# Altium schematic sheet MCU.SchDoc
size 228 x 127 mm; SheetNumber: 3; SheetTotal: 5
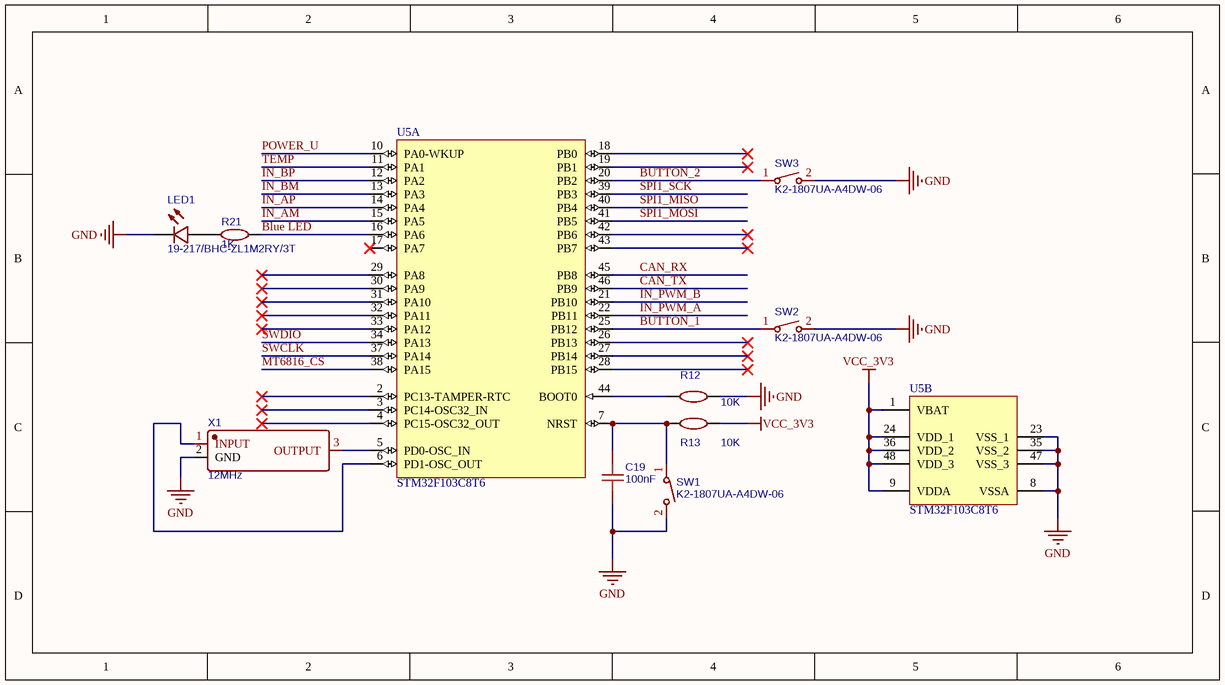
[diagram p0: MCU.SchDoc]

## Parts
C19  100nF  [C0603]
LED1  19-217/BHC-ZL1M2RY/3T  [LED0603-R-RD_BLUE]
R12  10K  [R0603]
R13  10K  [R0603]
R21  1K  [R0603]
SW1  K2-1807UA-A4DW-06  [KEY-SMD_L4.0-W2.9-L]
SW2  K2-1807UA-A4DW-06  [KEY-SMD_L4.0-W2.9-L]
SW3  K2-1807UA-A4DW-06  [KEY-SMD_L4.0-W2.9-L]
U5  STM32F103C8T6  [STM-LQFP48_L]  (parts A,B of 2)
X1  12MHz  [CRYSTAL-SMD_3P-L3.2-W1.3-P1.2-BL]

## Nets
GND: C19.1 LED1.2(C) R12.2 SW1.2 SW2.2 SW3.2 U5.8(VSSA) U5.23(VSS_1) U5.35(VSS_2) U5.47(VSS_3) X1.2(GND)
VCC_3V3: R13.2 U5.1(VBAT) U5.9(VDDA) U5.24(VDD_1) U5.36(VDD_2) U5.48(VDD_3)
Blue LED: R21.2 U5.16(PA6)
BUTTON_1: SW2.1 U5.25(PB12)
BUTTON_2: SW3.1 U5.20(PB2)
CAN_RX: U5.45(PB8)
CAN_TX: U5.46(PB9)
IN_AM: U5.15(PA5)
IN_AP: U5.14(PA4)
IN_BM: U5.13(PA3)
IN_BP: U5.12(PA2)
IN_PWM_A: U5.22(PB11)
IN_PWM_B: U5.21(PB10)
MT6816_CS: U5.38(PA15)
POWER_U: U5.10(PA0-WKUP)
SPI1_MISO: U5.40(PB4)
SPI1_MOSI: U5.41(PB5)
SPI1_SCK: U5.39(PB3)
SWCLK: U5.37(PA14)
SWDIO: U5.34(PA13)
TEMP: U5.11(PA1)
NetC19_2: C19.2 R13.1 SW1.1 U5.7(NRST)
NetLED1_1: LED1.1(A) R21.1
NetR12_1: R12.1 U5.44(BOOT0)
NetU5_5: U5.5(PD0-OSC_IN) X1.3(OUTPUT)
NetU5_6: U5.6(PD1-OSC_OUT) X1.1(INPUT)

Not connected (* = marked no-connect by the designer): U5 2(PC13-TAMPER-RTC)* 3(PC14-OSC32_IN)* 4(PC15-OSC32_OUT)* 17(PA7)* 18(PB0)* 19(PB1)* 26(PB13)* 27(PB14)* 28(PB15)* 29(PA8)* 30(PA9)* 31(PA10)* 32(PA11)* 33(PA12)* 42(PB6)* 43(PB7)*

## Library data of the parts
C19 = 100nF: BOM_Manufacturer: SAMSUNG; BOM_Manufacturer Part: CL10B104KB8NNNC; nameAlias: Capacitance; BOM_Supplier: LCSC; BOM_Supplier Part: C1591; BOM_JLCPCB Part Class: Extended Part; spicePre: C; spiceSymbolName: CL10B104KB8NNNC
LED1 = 19-217/BHC-ZL1M2RY/3T: BOM_Manufacturer: EVERLIGHT; BOM_Supplier: LCSC; BOM_Manufacturer Part: 19-217/BHC-ZL1M2RY/3T; BOM_Supplier Part: C72041; BOM_JLCPCB Part Class: Basic Part; spicePre: L; spiceSymbolName: 19-217/BHC-ZL1M2RY/3T
R12 R13 = 10K: BOM_Manufacturer: UniOhm; BOM_Manufacturer Part: 0603WAF1002T5E; nameAlias: Resistance (Ohms); BOM_Supplier: LCSC; BOM_Supplier Part: C25804; BOM_JLCPCB Part Class: Basic Part; spicePre: R; spiceSymbolName: 0603WAF1002T5E
R21 = 1K: BOM_Manufacturer: UniOhm; BOM_Manufacturer Part: 0603WAF1001T5E; nameAlias: Resistance (Ohms); BOM_Supplier: LCSC; BOM_Supplier Part: C21190; BOM_JLCPCB Part Class: Basic Part; spicePre: R; spiceSymbolName: 0603WAF1001T5E
SW1-SW3 = K2-1807UA-A4DW-06: BOM_Manufacturer: Korean Hroparts Elec; Contributor: LCSC; BOM_Supplier: LCSC; BOM_Supplier Part: C502307; BOM_Manufacturer Part: K2-1807UA-A4DW-06; BOM_JLCPCB Part Class: Extended Part; spicePre: S; spiceSymbolName: K2-1807UA-A4DW-06
U5 = CMP-0237-00215-3: ARM Cortex-M3 32-bit MCU, 64 KB Flash, 20 KB Internal RAM, 37 I/Os, 48-pin LQFP, -40 to 85 degC, Tray; Supply Voltage(Vcc) min (V): 2; Internal RAM Size (kB): 20; FLASH Size (Prog) (kB): 64; A/D Converter: 2x12-bit (10 Channel); I/Os (High Current): 37; Operating Frequency(F) (Processor speed) (MHz): 72; Core: ARM Cortex-M3; ComponentLink3Description: Package Specification; Mounting Technology: Surface Mount; PartNumber: STM32F103C8T6; PackageReference: LQFP48; Packing: Tray; ComponentLink3URL: http://www.st.com/st-web-ui/static/active/en/resource/technical/document/datasheet/DM00058181.pdf; DatasheetVersion: Rev. 16; ComponentLink1URL: http://www.st.com/web/en/home.html; PackageVersion: Rev. 6, 06/2013; ComponentLink2URL: http://www.st.com/st-web-ui/static/active/en/resource/technical/document/datasheet/CD00161566.pdf; ComponentLink1Description: Manufacturer URL; ComponentLink2Description: Datasheet; PackageDescription: 48-Pin Low Profile Quad Flat Package, 7 x 7 mm Body, 0.5 mm Pitch
X1 = 12MHz: BOM_Manufacturer: muRata(村田); BOM_Manufacturer Part: CSTNE12M0G52A000R0; nameAlias: Frequency; Contributor: LCSC; BOM_Supplier: LCSC; BOM_Supplier Part: C907957; BOM_JLCPCB Part Class: Extended Part; spicePre: X; spiceSymbolName: CSTNE12M0G52A000R0